# EAGLE design TuringFront (EAGLE 7.4.0)
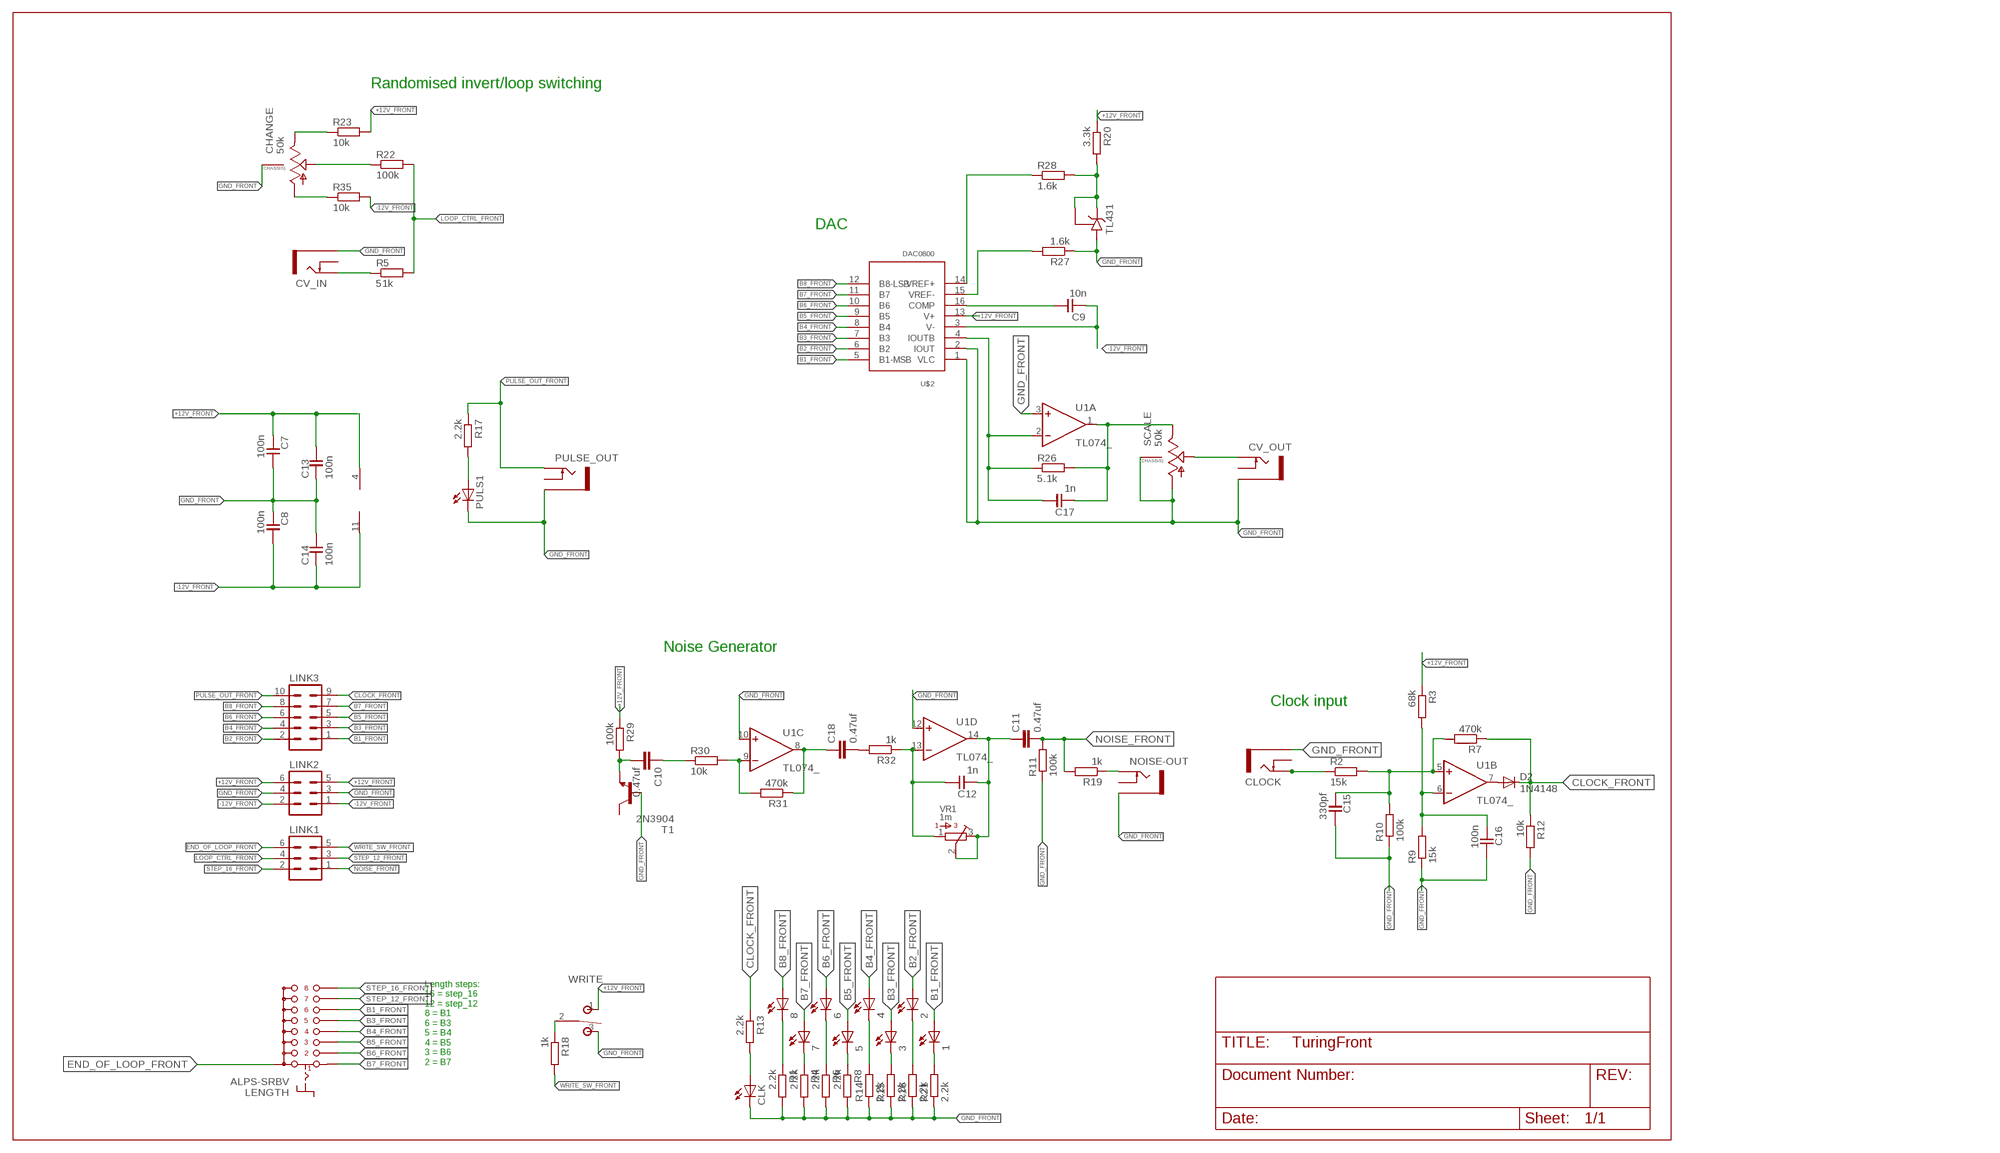
[diagram p0: schematic, sheet 1]

## Parts
1  LED3MM  [LED3MM]
2  LED3MM  [LED3MM]
3  LED3MM  [LED3MM]
4  LED3MM  [LED3MM]
5  LED3MM  [LED3MM]
6  LED3MM  [LED3MM]
7  LED3MM  [LED3MM]
8  LED3MM  [LED3MM]
C7  100n  C-EU050-024X044  [C050-024X044]
C8  100n  C-EU050-024X044  [C050-024X044]
C9  10n  C-EU050-024X044  [C050-024X044]
C10  0.47uf  C-EU050-035X075  [C050-035X075]
C11  0.47uf  C-EU050-035X075  [C050-035X075]
C12  1n  C-EU050-024X044  [C050-024X044]
C13  100n  C-EU050-024X044  [C050-024X044]
C14  100n  C-EU050-024X044  [C050-024X044]
C15  330pf  C-EU050-024X044  [C050-024X044]
C16  100n  C-EU050-024X044  [C050-024X044]
C17  1n  C-EU050-024X044  [C050-024X044]
C18  0.47uf  C-EU050-035X075  [C050-035X075]
CHANGE  50k  9MM_SNAP-IN_POT_CHASSIS  [9MM_SNAP-IN_POT]
CLK  LED3MM  [LED3MM]
CLOCK  THONKICONNNEW  [WQP-PJ301M-12_JACK]
CV_IN  THONKICONNNEW  [WQP-PJ301M-12_JACK]
CV_OUT  THONKICONNNEW  [WQP-PJ301M-12_JACK]
D2  1N4148  SMALL_DIODEDO35-7  [DO35-7]
LENGTH  ALPS-SRBV  [ALPS-SRBV]
LINK1  MA03-2BACKSIDE  [MA03-2BACKSIDE]
LINK2  MA03-2BACKSIDE  [MA03-2BACKSIDE]
LINK3  10PIN_BACKSIDE  [10PIN_BACKSIDE]
NOISE-OUT  THONKICONNNEW  [WQP-PJ301M-12_JACK]
PULS1  LED3MM  [LED3MM]
PULSE_OUT  THONKICONNNEW  [WQP-PJ301M-12_JACK]
R1  2.2k  R-EU_0207/7  [0207/7]
R2  15k  R-EU_0207/7  [0207/7]
R3  68k  R-EU_0207/7  [0207/7]
R4  2.2k  R-EU_0207/7  [0207/7]
R5  51k  R-EU_0207/7  [0207/7]
R6  2.2k  R-EU_0207/7  [0207/7]
R7  470k  R-EU_0207/7  [0207/7]
R8  2.2k  R-EU_0207/7  [0207/7]
R9  15k  R-EU_0207/7  [0207/7]
R10  100k  R-EU_0207/7  [0207/7]
R11  100k  RESISTOR7MM  [7MM_RESISTOR]
R12  10k  R-EU_0207/7  [0207/7]
R13  2.2k  R-EU_0207/7  [0207/7]
R14  2.2k  R-EU_0207/7  [0207/7]
R15  2.2k  R-EU_0207/7  [0207/7]
R16  2.2k  R-EU_0207/7  [0207/7]
R17  2.2k  R-EU_0207/7  [0207/7]
R18  1k  R-EU_0207/7  [0207/7]
R19  1k  R-EU_0207/7  [0207/7]
R20  3.3k  R-EU_0207/7  [0207/7]
R21  2.2k  R-EU_0207/7  [0207/7]
R22  100k  R-EU_0207/7  [0207/7]
R23  10k  R-EU_0207/7  [0207/7]
R26  5.1k  R-EU_0207/7  [0207/7]
R27  1.6k  R-EU_0207/7  [0207/7]
R28  1.6k  R-EU_0207/7  [0207/7]
R29  100k  R-EU_0207/7  [0207/7]
R30  10k  R-EU_0207/7  [0207/7]
R31  470k  R-EU_0207/7  [0207/7]
R32  1k  R-EU_0207/7  [0207/7]
R35  10k  R-EU_0207/7  [0207/7]
SCALE  50k  9MM_SNAP-IN_POT_CHASSIS  [9MM_SNAP-IN_POT]
T1  2N3904  [TO92]
TL431  TL431CLP  [TO92-CLP]
U1  TL074_  [DIL14]
U$2  DAC0800  [DIL16]
VR1  1m  BOURNS_3362P_TRIMMERP  [BOURNS_3362P_TRIMMER]
WRITE  T-80-T-SPDT-ON-OFF-ON  [M9040P]

## Nets
+12V_FRONT [power]: C7.2 C13.1 LINK2.5 LINK2.6 R3.1 R20.1 R23.2 R29.1 U1.4(P:V+) U$2.13(V+) WRITE.1(O)
-12V_FRONT [power]: C8.1 C9.2 C14.2 LINK2.1 LINK2.2 R35.2 U1.11(P:V-) U$2.3(V-)
B1_FRONT: 1.A LENGTH.F LINK3.1 U$2.5(B1-MSB)
B2_FRONT: 2.A LINK3.2 U$2.6(B2)
B3_FRONT: 3.A LENGTH.E LINK3.3 U$2.7(B3)
B4_FRONT: 4.A LENGTH.D LINK3.4 U$2.8(B4)
B5_FRONT: 5.A LENGTH.C LINK3.5 U$2.9(B5)
B6_FRONT: 6.A LENGTH.B LINK3.6 U$2.10(B6)
B7_FRONT: 7.A LENGTH.A LINK3.7 U$2.11(B7)
B8_FRONT: 8.A LINK3.8 U$2.12(B8-LSB)
CLOCK_FRONT: D2.C LINK3.9 R7.1 R12.1 R13.1
END_OF_LOOP_FRONT: LENGTH.COM2(A) LENGTH.COM(A) LINK1.6
GND_FRONT [ground]: C7.1 C8.2 C13.2 C14.1 C15.1 C16.1 CHANGE.CHASSIS2 CLK.K(C) CLOCK.P$3_SLEEVE(SLEEVE) CV_IN.P$3_SLEEVE(SLEEVE) CV_OUT.P$3_SLEEVE(SLEEVE) LINK2.3 LINK2.4 NOISE-OUT.P$3_SLEEVE(SLEEVE) PULS1.K(C) PULSE_OUT.P$3_SLEEVE(SLEEVE) R1.2 R4.2 R6.2 R8.2 R9.1 R10.1 R11.1 R12.2 R14.1 R15.1 R16.1 R21.1 R27.1 SCALE.1(A) SCALE.CHASSIS2 T1.2(B) TL431.A U1.3(A:+IN) U1.10(C:+IN) U1.12(D:+IN) U$2.1(VLC) U$2.2(IOUT) WRITE.3(S)
LOOP_CTRL_FRONT: LINK1.4 R5.2 R22.2
MAIN_OUT: C17.2 R26.2 SCALE.3(E) U1.1(A:OUT)
N$2: CLOCK.P$1_TIP(TIP) R2.1
N$3: CV_IN.P$1_TIP(TIP) R5.1
N$5: C15.2 R2.2 R7.2 R10.2 U1.5(B:+IN)
N$6: PULS1.A R17.2
N$8: D2.A U1.7(B:OUT)
N$9: C18.2 R32.2
N$11: R18.1 WRITE.2(P)
N$12: C16.2 R3.2 R9.2 U1.6(B:-IN)
N$13: C17.1 R26.1 U1.2(A:-IN) U$2.4(IOUTB)
N$15: CLK.A R13.2
N$16: C10.2 R29.2 T1.3(E)
N$18 [power]: R20.2 R28.2 TL431.C TL431.R
N$20: C10.1 R30.1
N$21: R30.2 R31.2 U1.9(C:-IN)
N$22: C18.1 R31.1 U1.8(C:OUT)
N$23: R27.2 U$2.15(VREF-)
N$25: C9.1 U$2.16(COMP)
N$26: R28.1 U$2.14(VREF+)
N$27: C12.1 R32.1 U1.13(D:-IN) VR1.1
N$30: 8.K(C) R1.1
N$31: 7.K(C) R4.1
N$32: 6.K(C) R6.1
N$33: 5.K(C) R8.1
N$34: 4.K(C) R14.2
N$35: 3.K(C) R15.2
N$36: 2.K(C) R16.2
N$37: 1.K(C) R21.2
N$39: CV_OUT.P$1_TIP(TIP) SCALE.2(S)
N$40: NOISE-OUT.P$1_TIP(TIP) R19.1
N$41: C11.1 C12.2 U1.14(D:OUT) VR1.2 VR1.3
N$43: CHANGE.2(S) R22.1
N$47: CHANGE.3(E) R23.1
N$48: CHANGE.1(A) R35.1
NOISE_FRONT: C11.2 LINK1.1 R11.2 R19.2
PULSE_OUT_FRONT: LINK3.10 PULSE_OUT.P$1_TIP(TIP) R17.1
STEP_12_FRONT: LENGTH.G LINK1.3
STEP_16_FRONT: LENGTH.H LINK1.2
WRITE_SW_FRONT: LINK1.5 R18.2
Unconnected: CLOCK.P$2_SWITCH(SWITCH) CV_IN.P$2_SWITCH(SWITCH) CV_OUT.P$2_SWITCH(SWITCH) NOISE-OUT.P$2_SWITCH(SWITCH) PULSE_OUT.P$2_SWITCH(SWITCH) T1.1(C)

## Notes on the sheet
- Randomised invert/loop switching
- DAC
- Noise Generator
- Clock input
- /Users/aash/Dropbox/Electronics/!MODULAR/design/logo copy.bmp
- Length steps: 
  16 = step_16
  12 = step_12
  8 = B1 
  6 = B3
  5 = B4 
  4 = B5
  3 = B6
  2 = B7

## Library data of the parts
1-8 CLK PULS1 = TomW:LED: LED OSRAM: - CHIPLED LG R971, LG N971, LY N971, LG Q971, LY Q971, LO R971, LY R971 LH N974, LH R974 LS Q976, LO Q976, LY Q976 LO Q996 - Hyper CHIPLED LW Q18S LB Q993, LB Q99A, LB R99A - SideLED LS A670, LO A670, LY A670, LG A670, LP A670 LB A673, LV A673, LT A673, LW A673 LH A674 LY A675 LS A676, LA A676, LO A676, LY A676, LW A676 LS A679, LY A679, LG A679 - Hyper Micro SIDELED® LS Y876, LA Y876, LO Y876, LY Y876 LT Y87S - SmartLED LW L88C, LW L88S LB L89C, LB L89S, LG L890 LS L89K, LO L89K, LY L89K LS L896, LA L896, LO L896, LY L896 - TOPLED LS T670, LO T670, LY T670, LG T670, LP T670 LSG T670, LSP T670, LSY T670, LOP T670, LYG T670 LG T671, LOG T671, LSG T671 LB T673, LV T673, LT T673, LW T673 LH T674 LS T676, LA T676, LO T676, LY T676, LB T676, LH T676, LSB T676, LW T676 LB T67C, LV T67C, LT T67C, LS T67K, LO T67K, LY T67K, LW E67C LS E67B, LA E67B, LO E67B, LY E67B, LB E67C, LV E67C, LT E67C LW T67C LS T679, LY T679, LG T679 LS T770, LO T770, LY T770, LG T770, LP T770 LB T773, LV T773, LT T773, LW T773 LH T774 LS E675, LA E675, LY E675, LS T675 LS T776, LA T776, LO T776, LY T776, LB T776 LHGB T686 LT T68C, LB T68C - Hyper Mini TOPLED® LB M676 - Mini TOPLED Santana® LG M470 LS M47K, LO M47K, LY M47K Source: http://www.osram.convergy.de LUXEON: - LUMILED® LXK2-PW12-R00, LXK2-PW12-S00, LXK2-PW14-U00, LXK2-PW14-V00 LXK2-PM12-R00, LXK2-PM12-S00, LXK2-PM14-U00 LXK2-PE12-Q00, LXK2-PE12-R00, LXK2-PE12-S00, LXK2-PE14-T00, LXK2-PE14-U00 LXK2-PB12-K00, LXK2-PB12-L00, LXK2-PB12-M00, LXK2-PB14-N00, LXK2-PB14-P00, LXK2-PB14-Q00 LXK2-PR12-L00, LXK2-PR12-M00, LXK2-PR14-Q00, LXK2-PR14-R00 LXK2-PD12-Q00, LXK2-PD12-R00, LXK2-PD12-S00 LXK2-PH12-R00, LXK2-PH12-S00 LXK2-PL12-P00, LXK2-PL12-Q00, LXK2-PL12-R00 Source: www.luxeon.com KINGBRIGHT: KA-3528ASYC Source: www.kingbright.com
C7-C9 C12-C17 = TomW:C-EU: CAPACITOR, European symbol
C10 C11 C18 = rcl:C-EU: CAPACITOR, European symbol
CHANGE SCALE = MusicThingModular:9MM_SNAP-IN_POT_CHASSIS: 9mm vertical snap-in pot, Alpha / Panasonic style, with a connection to the metal chassis for grounding
CLOCK CV_IN CV_OUT NOISE-OUT PULSE_OUT = MusicThingModular:THONKICONN: 3.5mm socket for Eurorack modular synths
D2 = MusicThingModular:SMALL_DIODE: Small Signal Diode
LENGTH = TomW:ALPS-SRBV
LINK1 LINK2 = MusicThingModular:MA03-2BACKSIDE: PIN HEADER
LINK3 = MusicThingModular:10PIN_BACKSIDE: PIN HEADER; OC_FARNELL: unknown; OC_NEWARK: unknown
R1-R10 R12-R23 R26-R32 R35 = TomW:R-EU_: RESISTOR, European symbol
R11 = MusicThingModular:RESISTOR: Standard resistor, various versions
T1 = transistor:2N3904: NPN TRANSISTOR
TL431 = TomW:TL431CLP: VOLTAGE REGULATOR
U1 = MusicThingModular:TL074: Generic Quad Op Amp
U$2 = TomW:DAC0800
VR1 = MusicThingModular:BOURNS_3362P_TRIMMER: 3362 Series 1/4" Square Trimmer
WRITE = MusicThingModular:T-80-T-SPDT-ON-OFF-ON

## Net classes
0 default: width 0.203 mm
1 power: width 0.406 mm
2 ground: width 0.406 mm

## Board
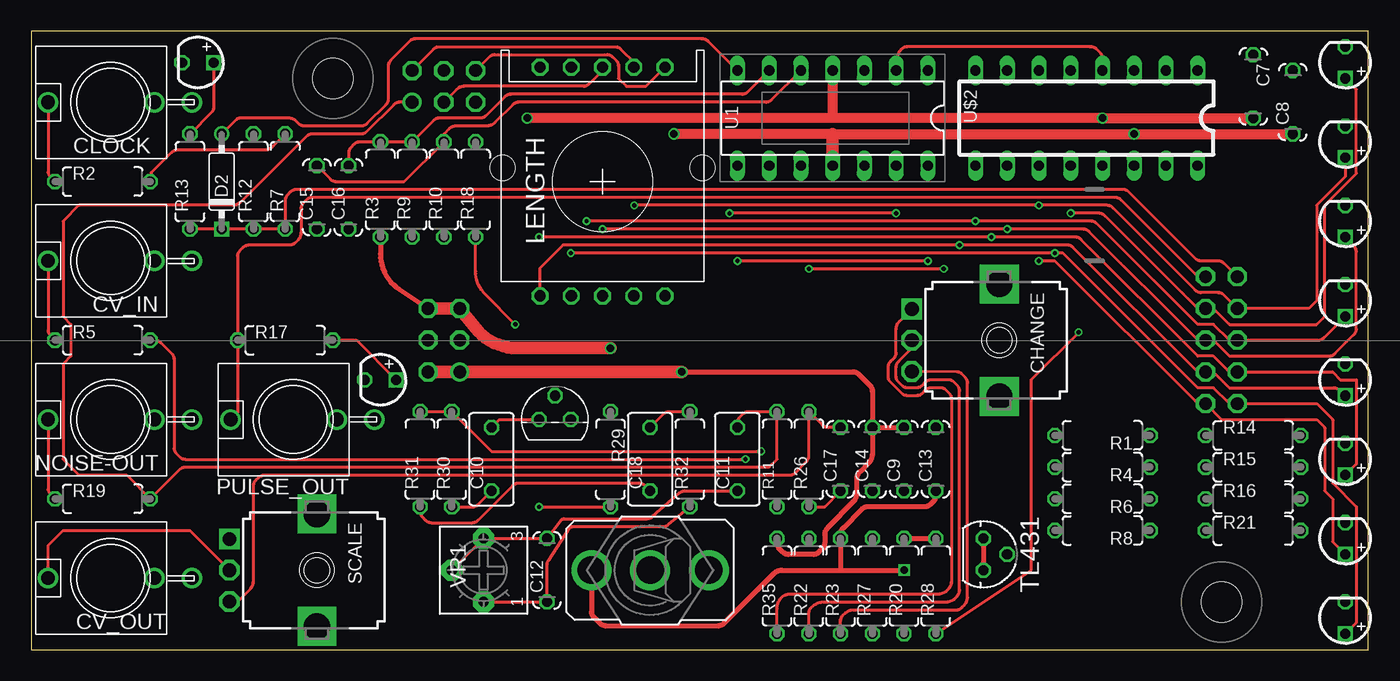
[diagram p1: board, top side]
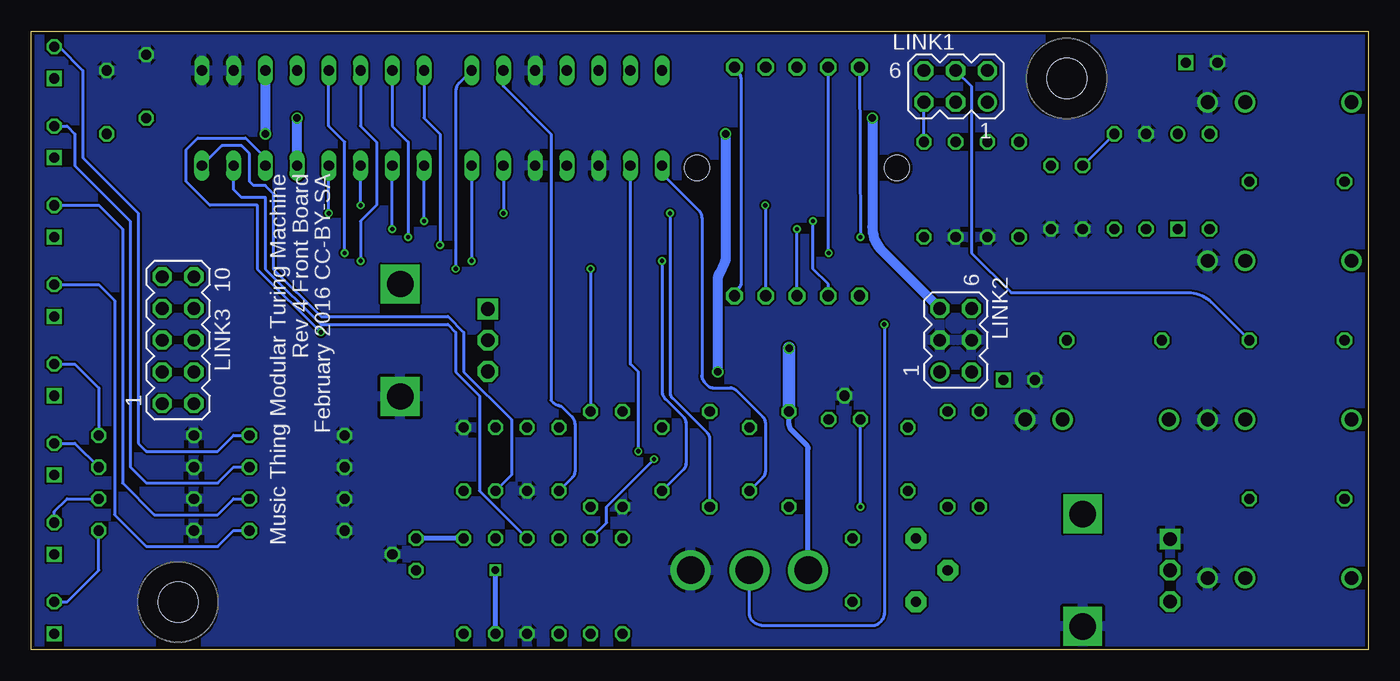
[diagram p2: board, bottom side, seen from below]

Size 107 x 49.5 mm. Coordinates in mm from the lower left corner, seen from the top.
Outline: 0,49.5 0,0 107,0 107,49.5 0,49.5
Copper layers (1*2*15*16): Top 0.035mm / dielectric 0.2mm / Route2 0.0175mm / dielectric 1.1mm / Route15 0.0175mm / dielectric 0.2mm / Bottom 0.035mm
Design rules "SeeedStudio_DRU_no_angle_20130527 *": minimum track width 6mil, minimum drill 12mil, track to track 6mil, track to pad 6mil, pad to pad 6mil, via to via 6mil, smd to smd 0mil, copper to edge 10mil, drill to drill 10mil, minimum pad ring 6mil, minimum via ring 6mil, stop-mask expansion 2mil, vias tented up to drill 30mil, thermal gap 10mil

### Footprints (pad centres in the part's own frame; a part is rotated, then mirrored left to right if it is on the bottom)
LED3MM = drill 0.813 square: A -1.27,0 | drill 0.813 octagon: K 1.27,0
C050-024X044 = drill 0.813 octagon: 1 -2.54,0; 2 2.54,0
C050-035X075 = drill 0.813 octagon: 1 -2.54,0; 2 2.54,0
9MM_SNAP-IN_POT = drill 1.1 square: 1 -2.5,-7 | drill 1.1 octagon: 2 0,-7; 3 2.5,-7 | drill 2.1 square: CHASSIS1 -4.5,0; CHASSIS2 4.5,0
WQP-PJ301M-12_JACK = drill 1.1: P$1_TIP 0,5; P$2_SWITCH 0,-3.5; P$3_SLEEVE 0,-6.5
DO35-7 = drill 0.813: A 3.81,0 | drill 0.813 square: C -3.81,0
ALPS-SRBV = drill 0.9 octagon: A 2.5,-9.15; B 0,-9.15; C -2.5,-9.15; COM 5,-9.15; COM2 5,9.15; D -5,-9.15; E -5,9.15; F -2.5,9.15; G 0,9.15; H 2.5,9.15 | hole 2: 8,1.1; -8,1.1
MA03-2BACKSIDE = drill 1.016: 1 -2.54,-1.27 | drill 1.016 octagon: 2 -2.54,1.27; 3 0,-1.27; 4 0,1.27; 5 2.54,-1.27; 6 2.54,1.27
10PIN_BACKSIDE = drill 1.016 octagon: 1 -5.08,-1.27; 2 -5.08,1.27; 3 -2.54,-1.27; 4 -2.54,1.27; 5 0,-1.27; 6 0,1.27; 7 2.54,-1.27; 8 2.54,1.27; 9 5.08,-1.27; 10 5.08,1.27
0207/7 = drill 0.813 octagon: 1 -3.81,0; 2 3.81,0
7MM_RESISTOR = drill 0.813 octagon: 1 -3.81,0; 2 3.81,0
TO92 = drill 0.813 octagon: 1 1.27,0; 2 0,1.905; 3 -1.27,0
TO92-CLP = drill 0.813 octagon: A 0,1.905; C 1.27,0; R -1.27,0
DIL14 = drill 0.813 long: 1 -7.62,-3.81; 2 -5.08,-3.81; 3 -2.54,-3.81; 4 0,-3.81; 5 2.54,-3.81; 6 5.08,-3.81; 7 7.62,-3.81; 8 7.62,3.81; 9 5.08,3.81; 10 2.54,3.81; 11 0,3.81; 12 -2.54,3.81; 13 -5.08,3.81; 14 -7.62,3.81
DIL16 = drill 0.813 long: 1 -8.89,-3.81; 2 -6.35,-3.81; 3 -3.81,-3.81; 4 -1.27,-3.81; 5 1.27,-3.81; 6 3.81,-3.81; 7 6.35,-3.81; 8 8.89,-3.81; 9 8.89,3.81; 10 6.35,3.81; 11 3.81,3.81; 12 1.27,3.81; 13 -1.27,3.81; 14 -3.81,3.81; 15 -6.35,3.81; 16 -8.89,3.81
MOUNTING_HOLE = hole 3.2: 0,0
BOURNS_3362P_TRIMMER = drill 0.813 pad 1.676 octagon: 1 -2.54,0; 2 0,2.54; 3 2.54,0
M9040P = drill 2.2: 1 0,4.699 | drill 2.2 pad 3: 2 0,0; 3 0,-4.699

### Placement (x,y rotation side)
1  105.16,2.54 90 top
2  105.16,8.89 90 top
3  105.16,15.24 90 top
4  105.16,21.59 90 top
5  105.16,27.94 90 top
6  105.16,34.29 90 top
7  105.16,40.64 90 top
8  105.16,46.99 90 top
C7  97.79,45.09 270 top
C8  100.97,43.81 90 top
C9  69.85,15.24 90 top
C10  36.83,15.24 90 top
C11  56.52,15.24 90 top
C12  41.27,6.35 90 top
C13  72.39,15.24 90 top
C14  67.31,15.24 90 top
C15  22.86,36.2 90 top
C16  25.4,36.2 90 top
C17  64.77,15.24 90 top
C18  49.53,15.24 90 top
CHANGE  77.47,24.77 270 top
CLK  13.34,46.99 180 top
CLOCK  6.35,43.81 90 top
CV_IN  6.35,31.11 90 top
CV_OUT  6.35,5.71 90 top
D2  15.24,37.47 90 top
LENGTH  45.72,37.47 0 top
LINK1  33.02,45.09 0 top
LINK2  33.02,24.77 90 top
LINK3  95.25,24.77 90 top
NOISE-OUT  6.35,18.41 90 top
PULS1  27.94,21.59 180 top
PULSE_OUT  20.95,18.41 90 top
R1  85.72,17.14 180 top
R2  5.71,37.47 0 top
R3  27.94,36.83 90 top
R4  85.72,14.61 180 top
R5  5.71,24.77 0 top
R6  85.72,12.06 180 top
R7  20.32,37.47 90 top
R8  85.72,9.53 180 top
R9  30.48,36.83 90 top
R10  33.02,36.83 90 top
R11  59.69,15.24 90 top
R12  17.78,37.47 90 top
R13  12.7,37.47 90 top
R14  97.79,17.14 0 top
R15  97.79,14.61 0 top
R16  97.79,12.06 0 top
R17  20.32,24.77 0 top
R18  35.56,36.83 90 top
R19  5.71,12.06 0 top
R20  69.85,5.08 90 top
R21  97.79,9.53 0 top
R22  62.23,5.08 90 top
R23  64.77,5.08 90 top
R26  62.23,15.24 90 top
R27  67.31,5.08 90 top
R28  72.39,5.08 90 top
R29  46.35,15.24 270 top
R30  33.66,15.24 90 top
R31  31.11,15.24 90 top
R32  52.7,15.24 90 top
R35  59.69,5.08 90 top
SCALE  22.86,6.35 270 top
T1  41.91,18.41 0 top
TL431  76.2,7.62 270 top
U1  64.14,42.55 180 top
U$2  84.45,42.55 180 top
U$4  [MOUNTING_HOLE]  24.13,45.72 0 top
U$5  [MOUNTING_HOLE]  95.25,3.81 0 top
VR1  36.2,6.35 90 top
WRITE  49.53,6.35 90 top

### Tracks (layer width: path | path; a pad name or v marks a point on that pad's centre or on a via)
+12V_FRONT  (via drill 0.6)
  Top 0.406: 64.77,6.35 R23.2 64.77,9.26 arc-45 64.96,9.71 66.49,11.24 arc-45 66.94,11.43 71.49,11.43 arc45 71.94,11.62 72.2,11.88 arc45 72.39,12.33 C13.1 | WRITE.1 44.83,2.98 arc45 44.97,2.66 45.53,2.09 arc45 45.98,1.91 54.98,1.91 arc45 55.43,2.09 59.43,6.09 arc-45 60.06,6.35 64.77,6.35 | R3.1 27.94,31.68 arc56 29.46,28.83 LINK2.6 | 64.77,6.35 v69.85,6.35
  Top 0.813: 64.14,42.55 v85.72,42.55 C7.2 | 64.14,42.55 v39.69,42.55 | U1.4 64.14,42.55
  Top 1.016: v46.35,24.13 38.88,24.13 arc-51 35.55,25.73 LINK2.5 LINK2.6
  Bottom 0.406: WRITE.1 44.83,16.07 arc-45 44.97,16.39 46.17,17.59 arc45 46.35,18.04 R29.1 | R20.1 v69.85,6.35
  Bottom 0.813: v39.69,42.55 39.69,33.83 arc-45 38.89,31.9 LINK2.5 | U$2.13 v85.72,42.55
  Bottom 1.016: v46.35,24.13 R29.1
-12V_FRONT  (via drill 0.6)
  Top 0.406: v52.07,22.23 65.78,22.23 arc-45 66.23,22.04 67.12,21.14 arc-45 67.31,20.69 C14.2 | C14.2 C9.2 | C14.2 67.31,15.61 arc-45 67.05,14.98 66.3,14.23 arc45 66.04,13.6 66.04,12.44 arc-45 65.78,11.8 63.76,9.79 arc45 63.5,9.15 63.5,8.52 arc-45 63.31,8.07 63.05,7.81 arc-45 62.6,7.62 60.59,7.62 arc-45 60.14,7.81 59.88,8.07 arc-45 59.69,8.52 R35.2
  Top 0.813: v51.44,41.27 64.14,41.27 v88.27,41.27 C8.1
  Top 1.016: LINK2.2 LINK2.1 v52.07,22.23 | U1.11 64.14,41.27
  Bottom 0.813: v51.44,41.27 51.44,31.27 arc27 51.5,30.98 51.94,30.11 arc-27 52.07,29.55 v52.07,22.23 | U$2.3 v88.27,41.27
B1_FRONT  (via drill 0.33)
  Top 0.254: v43.18,31.75 v81.92,31.75 82.55,31.75 93.34,20.95 94.61,20.95 95.89,19.68 LINK3.1 102.87,19.68 104.14,18.41 104.14,13.34 106.05,11.43 106.05,2.16 1.A
  Bottom 0.254: v81.92,31.75 81.92,40.64 83.19,41.91 U$2.5 | v43.18,31.75 43.18,46.58 LENGTH.F
B2_FRONT  (via drill 0.33)
  Top 0.254: v80.64,31.11 81.92,31.11 93.34,19.68 LINK3.2 95.25,18.41 102.87,18.41 103.5,17.78 103.5,12.7 104.14,12.06 104.14,8.64 2.A
  Bottom 0.254: U$2.6 80.64,41.91 79.38,40.64 79.38,35.56 80.64,34.29 v80.64,31.11
B3_FRONT  (via drill 0.33)
  Top 0.254: v40.64,33.02 v76.83,33.02 83.56,33.02 arc-45 84.01,32.83 93.34,23.5 94.61,23.5 95.89,22.23 LINK3.3 104.14,22.23 104.78,21.59 106.05,21.59 106.05,14.86 3.A
  Bottom 0.254: LENGTH.E v40.64,33.02 | U$2.7 78.11,41.91 76.83,40.64 v76.83,33.02
B4_FRONT  (via drill 0.33)
  Top 0.254: 4.A 104.74,20.74 arc45 104.21,20.95 95.89,20.95 94.61,22.23 LINK3.4 93.34,22.23 83.37,32.2 arc45 82.92,32.38 v74.3,32.38 42.55,32.38 40.72,30.56 LENGTH.D
  Bottom 0.254: U$2.8 75.56,42.55 74.3,41.27 v74.3,32.38
B5_FRONT  (via drill 0.33)
  Top 0.254: 5.A 103.47,24.98 arc-45 102.94,24.77 LINK3.5 95.89,24.77 94.61,26.04 93.34,26.04 85.28,34.1 arc45 84.83,34.29 v75.56,34.29 v44.45,34.29
  Bottom 0.254: LENGTH.C 43.22,29.25 44.45,30.48 v44.45,34.29 | v75.56,34.29 U$2.9
B6_FRONT  (via drill 0.33)
  Top 0.254: 6.A 105.83,32.35 arc-45 106.05,31.82 106.05,25.66 arc-45 105.86,25.21 104.33,23.68 arc-45 103.88,23.5 95.89,23.5 94.61,24.77 LINK3.6 93.34,24.77 84.64,33.47 arc45 84.19,33.66 v78.11,33.66 v45.72,33.66
  Bottom 0.254: LENGTH.B v45.72,33.66 | v78.11,33.66 U$2.10
B7_FRONT  (via drill 0.33)
  Top 0.254: v48.26,35.56 v80.64,35.56 86.1,35.56 arc-45 86.55,35.37 93.16,28.76 arc45 93.61,28.57 94.99,28.57 arc-45 95.44,28.39 LINK3.7 102.23,27.3 102.87,27.94 102.87,35.56 105.16,37.85 7.A
  Bottom 0.254: LENGTH.A 48.22,35.52 v48.26,35.56 | v80.64,35.56 U$2.11
B8_FRONT  (via drill 0.33)
  Top 0.254: v83.19,34.92 85.46,34.92 arc-45 85.91,34.74 93.34,27.3 LINK3.8 94.61,27.3 95.89,26.04 102.87,26.04 103.5,26.67 103.5,35.56 106.05,38.1 106.05,44.83 8.A
  Bottom 0.254: v83.19,34.92 U$2.12
CLOCK_FRONT
  Top 0.254: R13.1 D2.C R12.1 R7.1 20.32,35.93 arc-45 20.51,36.38 20.77,36.64 arc-45 21.22,36.83 87.37,36.83 arc-45 87.82,36.64 93.16,31.3 arc45 93.61,31.11 94.99,31.11 arc-45 95.44,30.93 LINK3.9
END_OF_LOOP_FRONT
  Top 0.254: LINK1.6 36.64,47.44 arc-45 37.09,47.62 46.09,47.62 arc-45 46.54,47.44 46.8,47.18 arc-45 46.99,46.73 46.99,45.72 47.62,45.09 49.19,45.09 LENGTH.COM2
  Bottom 0.254: LENGTH.COM 50.26,29.06 arc-32 50.16,29.39 50.16,45.57 arc-41 50.44,46.29 LENGTH.COM2
GND_FRONT
  pour Bottom: 0,50.8 107.95,50.8 107.95,-1.27 -1.27,-1.27 -1.27,50.8
LOOP_CTRL_FRONT  (via drill 0.33)
  Top 0.254: R5.2 9.9,24.77 arc-45 10.35,24.58 11.24,23.68 arc-45 11.43,23.23 11.43,16.14 arc45 11.62,15.69 11.88,15.43 arc45 12.33,15.24 v57.15,15.24
  Bottom 0.254: LINK1.4 31.75,45.09 31.75,31.75 28.57,28.57 14.42,28.57 arc45 12.57,27.81 R5.2 | R22.2 60.96,10.16 60.96,11.43 v57.15,15.24
MAIN_OUT  (via drill 0.33)
  Top 0.254: SCALE.3 16.55,3.85 17.52,4.82 arc45 17.78,5.45 17.78,13.07 arc-45 17.97,13.52 18.23,13.78 arc-45 18.68,13.97 60.7,13.97 arc45 61.15,14.16 62.04,15.05 arc45 62.23,15.5 R26.2 63.31,17.97 arc45 63.76,17.78 C17.2 | v73.03,30.48 v62.23,30.48
  Bottom 0.254: U1.1 72.76,45.35 arc-45 73.03,44.71 v73.03,30.48 | v62.23,30.48 R26.2
N$2
  Top 0.254: CLOCK.P$1_TIP 1.35,38.25 arc45 1.51,37.86 R2.1
N$3
  Top 0.254: CV_IN.P$1_TIP 1.35,25.55 arc45 1.51,25.16 R5.1
N$5
  Top 0.254: R2.2 9.53,37.84 arc-45 9.71,38.29 11.24,39.82 arc-45 11.69,40.01 18.68,40.01 arc45 19.31,40.27 R7.2 | U1.5 59.24,44 arc-45 58.79,43.81 39,43.81 arc45 38.55,43.63 37.09,42.17 arc-45 36.46,41.91 34.03,41.91 arc45 33.39,41.65 33.02,41.27 R10.2 29.84,37.47 24.39,37.47 arc-45 23.94,37.65 C15.2
  Bottom 0.254: C15.2 R7.2
N$6
  Top 0.254: R17.2 26.04,24.77 PULS1.A
N$8
  Top 0.254: U1.7 54.24,48.63 arc45 53.6,48.9 30.74,48.9 arc45 30.29,48.71 28.76,47.18 arc45 28.57,46.73 28.57,44.08 arc-45 28.39,43.63 26.86,42.1 arc-45 26.41,41.91 21.85,41.91 arc-45 21.4,42.1 21.22,42.28 arc45 20.58,42.55 16.77,42.55 arc45 16.32,42.36 D2.A
N$9
  Top 0.254: C18.2 50.61,18.86 arc-45 51.06,19.05 R32.2
N$11  (via drill 0.33)
  Top 0.254: v38.73,26.04 36.33,28.44 arc-45 35.56,30.29 R18.1
  Bottom 0.254: v38.73,26.04 38.73,2.91 arc45 39,2.28 39.18,2.09 arc45 39.63,1.91 48.37,1.91 arc45 49.27,2.28 arc45 49.53,2.91 WRITE.2
N$12
  Top 0.254: U1.6 57.34,44.64 arc-45 56.89,44.45 38.36,44.45 arc45 37.91,44.26 36.38,42.73 arc-45 35.93,42.55 32.65,42.55 arc45 32.2,42.36 R9.2 R3.2 26.3,40.64 arc45 25.85,40.45 25.59,40.19 arc45 25.4,39.74 C16.2
N$13
  Top 0.254: U$2.4 85.72,47.36 arc45 85.54,47.81 85.35,48 arc45 84.72,48.26 70.11,48.26 arc45 69.66,48.07 69.63,48.04 arc45 69.22,47.04 U1.2 | R26.1 63.5,11.43 C17.1
  Bottom 0.254: C17.1 63.69,13.78 arc-45 63.5,14.23 63.5,18.04 arc-45 63.76,18.68 64.58,19.5 arc45 65.41,19.95 65.41,41.27 69.22,45.09 U1.2
N$15
  Top 0.254: CLK.A 14.61,43.44 arc-45 14.42,42.99 R13.2
N$16  (via drill 0.33)
  Top 0.254: C10.2 37.47,18.41 T1.3 | v40.64,11.43 R29.2
  Bottom 0.254: v40.64,11.43 T1.3
N$18
  Top 0.406: R20.2 R28.2 | TL431.R TL431.C
  Bottom 0.406: R28.2 TL431.R
N$20
  Top 0.254: R30.1 35.3,11.43 arc45 35.75,11.62 C10.1
N$21  (via drill 0.33)
  Top 0.254: R31.2 R30.2 36.83,15.88 v58.42,15.88
  Bottom 0.254: v58.42,15.88 58.42,22.23 59.05,22.86 U1.9
N$22
  Top 0.254: R31.1 31.11,11.06 arc45 31.3,10.61 31.56,10.35 arc45 32.01,10.16 35.3,10.16 arc45 35.75,10.35 38.55,13.15 arc-45 39,13.34 48.63,13.34 arc-45 49.08,13.15 C18.1
  Bottom 0.254: C18.1 48.45,13.78 arc-45 48.26,14.23 48.26,18.15 arc-45 48.45,18.6 50.61,20.77 arc-45 51.06,20.95 52.44,20.95 arc45 52.89,21.14 53.08,21.33 arc45 53.34,21.96 53.34,34.55 arc-45 53.6,35.19 56.52,38.1 U1.8
N$23
  Bottom 0.254: R27.2 71.12,12.7 71.12,20.32 73.03,22.23 73.03,25.4 73.66,26.04 83.82,26.04 88.27,30.48 88.27,36.2 90.17,36.2 90.81,36.83 U$2.15
N$25
  Bottom 0.254: C9.1 68.58,13.97 68.58,18.41 72.39,22.23 72.39,25.4 73.66,26.67 83.82,26.67 87.63,30.48 87.63,36.51 88.27,37.15 89.22,37.15 89.53,37.47 89.53,39.69 90.17,40.32 91.76,40.32 U$2.16
N$26  (via drill 0.33)
  Top 0.254: v83.82,25.4 80.01,21.59 80.01,6.35 R28.1
  Bottom 0.254: v83.82,25.4 88.9,30.48 88.9,35.56 92.71,35.56 94.61,37.47 94.61,40.01 93.66,40.96 89.85,40.96 88.27,39.37 U$2.14
N$27  (via drill 0.33)
  Top 0.254: VR1.1 C12.1 41.27,6.74 arc-42 41.44,7.17 43.09,9.74 arc-48 43.32,9.84 50.54,9.84 arc40 51,10.01 R32.1 | v69.22,34.92 v55.88,34.92
  Bottom 0.254: U1.13 v69.22,34.92 | v55.88,34.92 55.88,20.58 arc-45 55.69,20.13 52.89,17.33 arc45 52.7,16.88 R32.1
N$30
  Bottom 0.254: 8.K 104.78,48.26 102.87,46.35 102.87,39.37 98.42,34.92 98.42,16.51 97.79,15.88 92.08,15.88 90.81,17.14 R1.1
N$31
  Bottom 0.254: 7.K 104.14,41.91 103.5,41.27 103.5,38.73 99.06,34.29 99.06,14.61 97.79,13.34 92.08,13.34 90.81,14.61 R4.1
N$32
  Bottom 0.254: 6.K 101.6,35.56 99.69,33.66 99.69,13.34 97.16,10.79 92.08,10.79 90.81,12.06 R6.1
N$33
  Bottom 0.254: 5.K 101.6,29.21 100.33,27.94 100.33,10.79 97.79,8.26 92.08,8.26 90.81,9.53 R8.1
N$34
  Bottom 0.254: 4.K 103.5,22.86 101.6,20.95 R14.2
N$35
  Bottom 0.254: 3.K 103.5,16.51 R15.2
N$36
  Bottom 0.254: 2.K 105.16,11.05 104.14,12.06 R16.2
N$37
  Bottom 0.254: 1.K 104.14,3.81 101.6,6.35 R21.2
N$39
  Top 0.254: CV_OUT.P$1_TIP 1.35,8.34 2.54,9.53 12.69,9.53 SCALE.2
N$40
  Top 0.254: NOISE-OUT.P$1_TIP 1.35,12.85 arc45 1.51,12.46 R19.1
N$41  (via drill 0.33)
  Top 0.254: VR1.2 VR1.3 C12.2 42.46,10.4 arc-40 42.66,10.48 49.26,10.48 arc41 49.73,10.65 51.89,12.54 arc-41 52.31,12.7 C11.1 | v71.75,31.11 v56.52,31.11
  Bottom 0.254: U1.14 v71.75,31.11 | v56.52,31.11 56.52,20.69 arc-45 56.25,20.06 54.8,18.6 arc45 54.61,18.15 54.61,14.87 arc45 54.8,14.42 C11.1
N$43
  Top 0.254: R22.1 62.23,2.87 arc-45 62.45,3.39 arc-45 63.45,3.81 73.13,3.81 arc45 74.03,4.18 arc45 74.3,4.82 74.3,20.69 arc45 74.11,21.14 73.85,21.4 arc45 73.4,21.59 72.02,21.59 arc45 71.57,21.4 71.31,21.14 arc-45 70.86,20.95 70.11,20.95 arc-45 69.66,21.14 69.4,21.4 arc-45 69.22,21.85 69.22,22.6 arc-45 69.4,23.05 70.48,24.13 70.48,24.75 CHANGE.2
N$47
  Top 0.254: R23.1 64.77,2.28 arc-45 64.96,2.73 65.14,2.91 arc-45 65.78,3.17 74.03,3.17 arc45 74.48,3.36 74.67,3.55 arc45 74.93,4.18 74.93,21.33 arc44 74.75,21.77 74.5,22.03 arc46 74.05,22.23 CHANGE.3
N$48
  Top 0.254: R35.1 59.69,3.28 arc-45 60.06,4.18 arc-45 60.7,4.45 72.5,4.45 arc45 73.4,4.82 arc45 73.66,5.45 73.66,20.06 arc45 73.47,20.51 73.21,20.77 arc45 72.76,20.95 72.02,20.95 arc45 71.57,20.77 71.31,20.51 arc-45 70.86,20.32 70.11,20.32 arc-45 69.66,20.51 68.77,21.4 arc-45 68.58,21.85 68.58,22.6 arc-45 68.77,23.05 69.03,23.31 arc45 69.22,23.76 69.22,25.64 arc-45 69.47,26.27 CHANGE.1
NOISE_FRONT
  Top 0.254: C11.2 56.52,18.15 arc-45 56.7,18.6 56.96,18.86 arc-45 57.41,19.05 R11.2 59.69,15.24 59.05,14.61 12.33,14.61 arc45 11.88,14.42 R19.2 7.62,13.97 3.81,13.97 2.54,15.24 2.54,22.86 3.17,23.5 3.17,26.04 2.54,26.67 2.54,34.29 3.81,35.56 16.14,35.56 arc45 16.77,35.82 22.04,41.09 arc-45 22.49,41.27 26.41,41.27 arc45 26.86,41.46 29.02,43.63 arc-45 29.47,43.81 LINK1.1
PULSE_OUT_FRONT
  Top 0.254: PULSE_OUT.P$1_TIP 16.51,18.97 R17.1 16.51,31.49 arc-45 16.7,31.94 16.88,32.12 arc-45 17.52,32.38 20.69,32.38 arc45 21.14,32.57 21.33,32.76 arc45 21.59,33.39 21.59,35.3 arc-45 21.78,35.75 22.04,36.01 arc-45 22.49,36.2 86.73,36.2 arc-45 87.18,36.01 93.34,29.84 LINK3.10
STEP_12_FRONT
  Top 0.254: LENGTH.G 45.72,46.35 44.64,45.27 arc-45 44.19,45.09 34.66,45.09 arc45 34.03,44.82 LINK1.3
STEP_16_FRONT
  Top 0.254: LINK1.2 32.2,48.07 arc-45 32.65,48.26 46.73,48.26 arc-45 47.18,48.07 48.26,46.99 48.26,46.66 LENGTH.H
WRITE_SW_FRONT
  Bottom 0.254: R18.2 LINK1.5

### Text on the board
bPlace: Music Thing Modular Turing Machine / Rev 4 Front Board / February 2016 CC-BY-SA